# EAGLE design main (EAGLE 7.3.0)
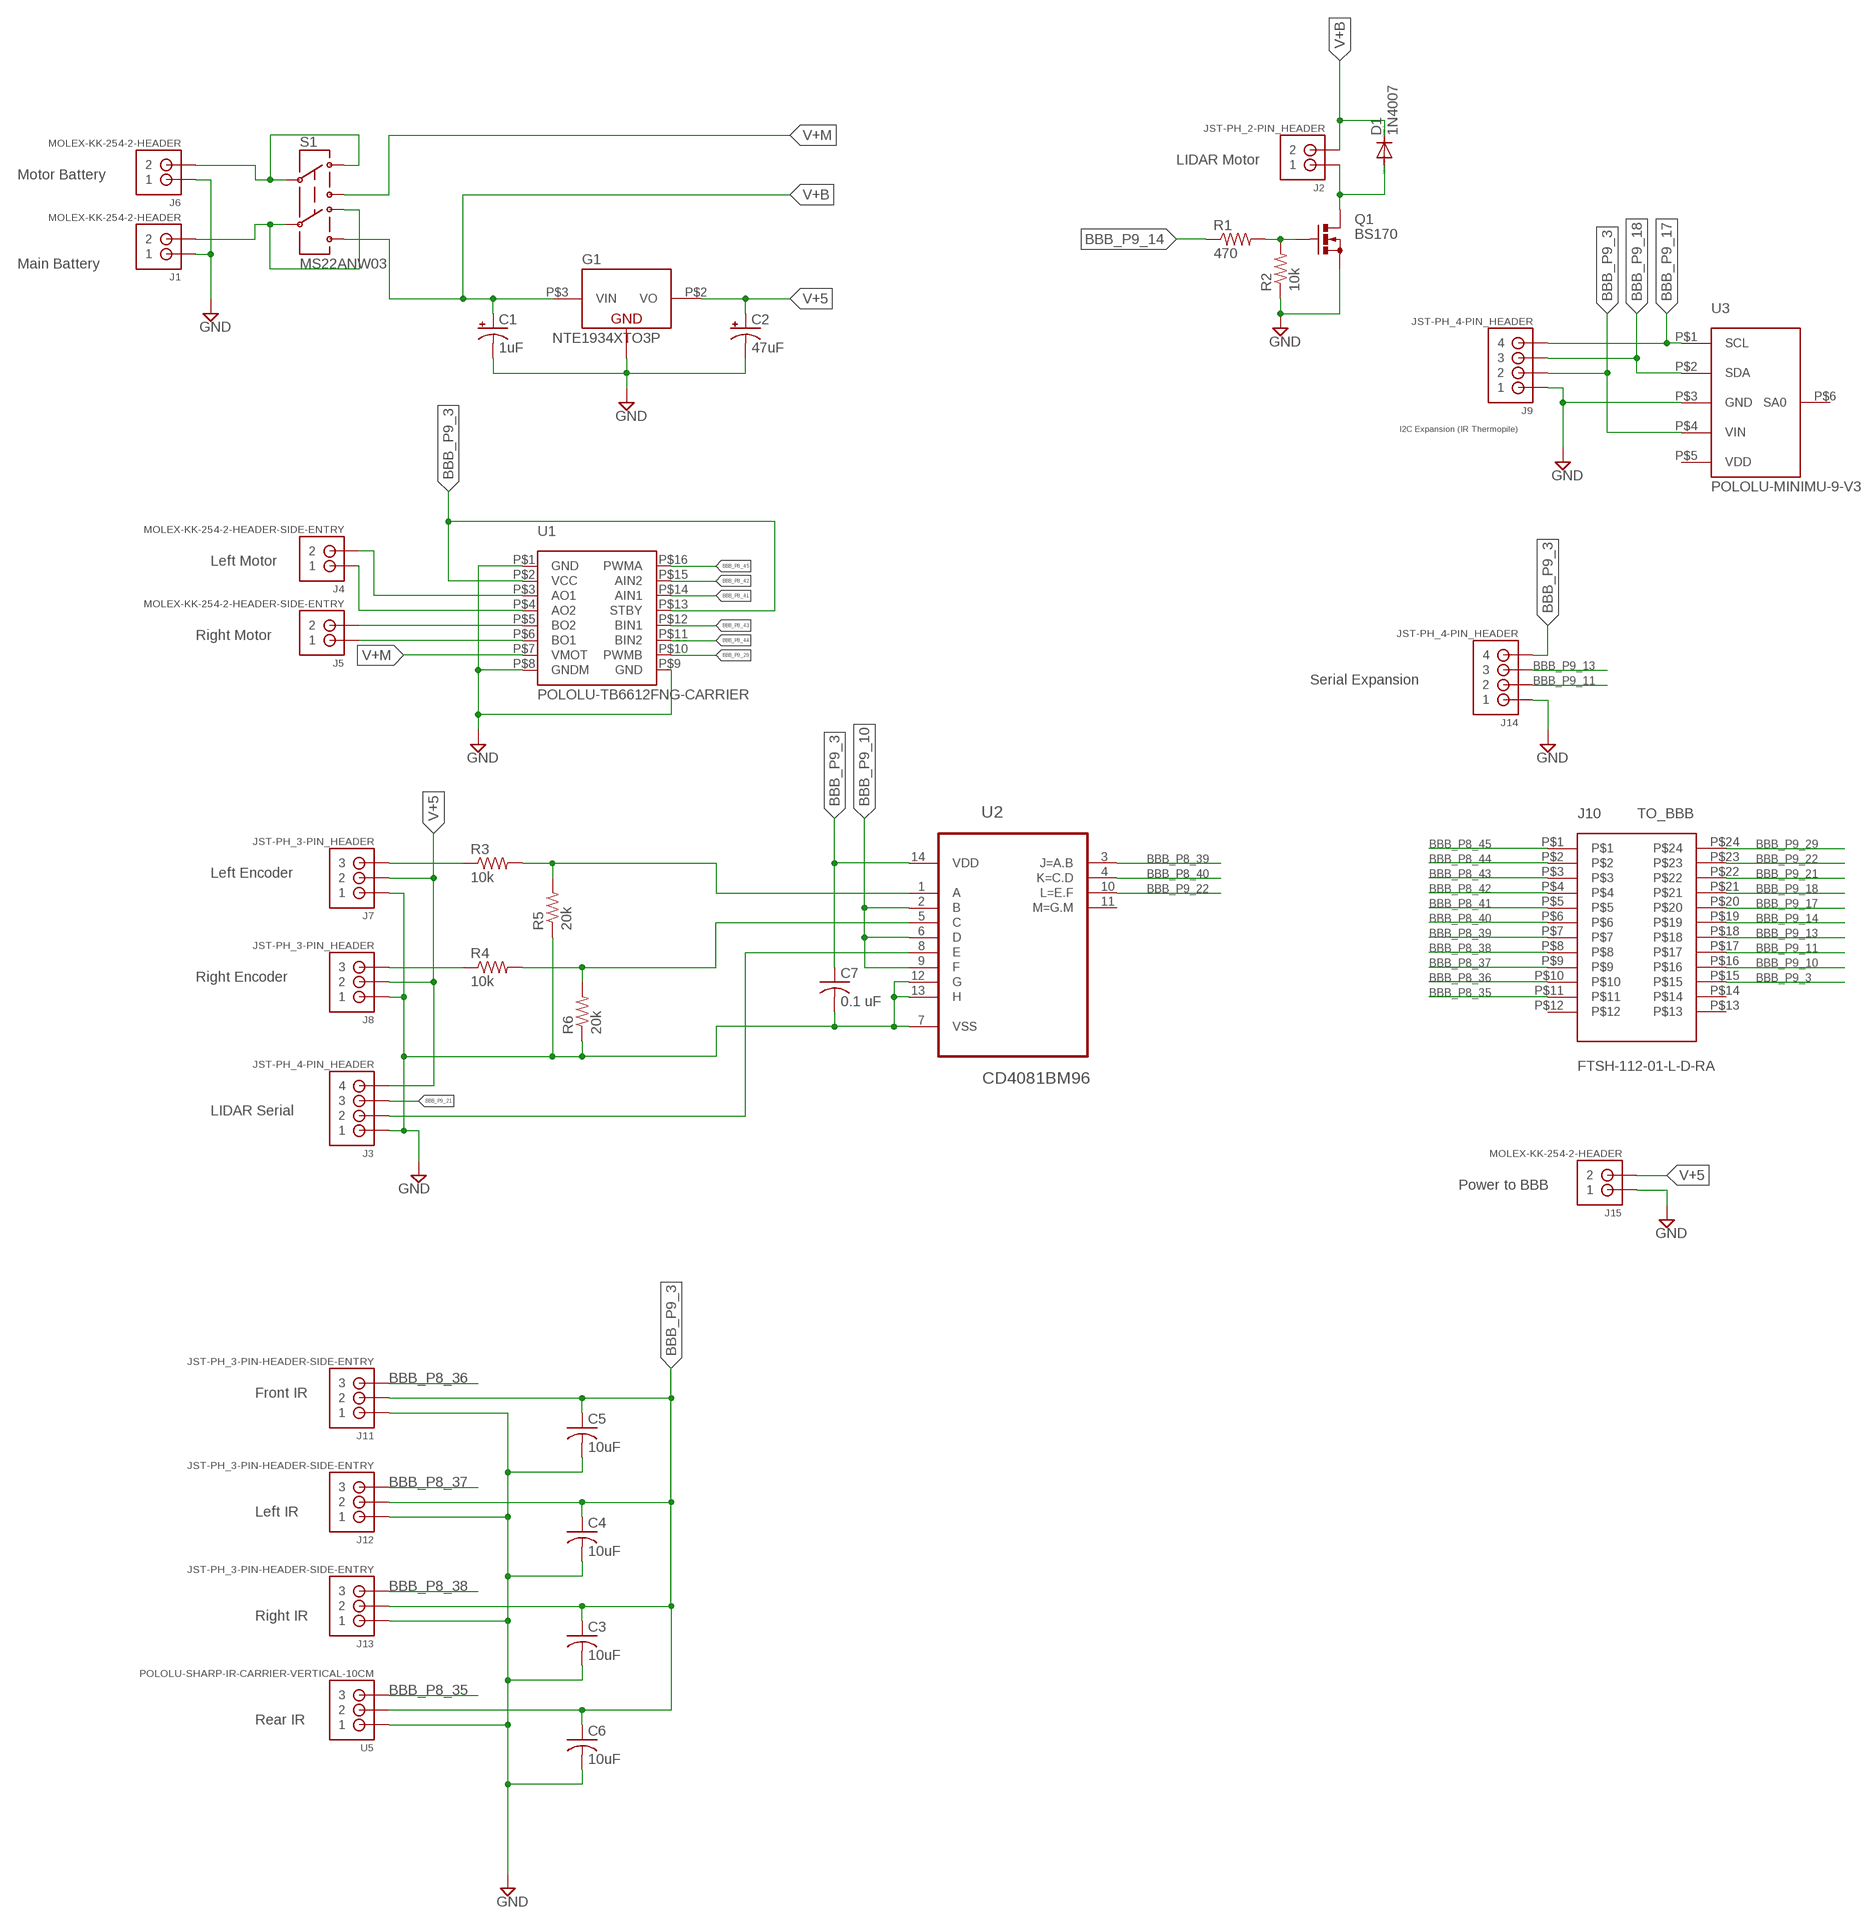
[diagram p0: schematic, sheet 1]

## Parts
C1  1uF  CPOL-USB  [PANASONIC_B]
C2  47uF  CPOL-USC  [PANASONIC_C]
C3  10uF  C-USC0603  [C0603]
C4  10uF  C-USC0603  [C0603]
C5  10uF  C-USC0603  [C0603]
C6  10uF  C-USC0603  [C0603]
C7  0.1 uF  C-USC0603  [C0603]
D1  1N4007  1N4004  [DO41-10]
G1  NTE1934XTO3P  [TO3P]
J1  MOLEX-KK-254-2-HEADER  [MOLEX-KK-254-2-HEADER]
J2  JST-PH_2-PIN_HEADER  [JST_B2B-PH_HEADER]
J3  JST-PH_4-PIN_HEADER  [JST_B4B-PH_HEADER]
J4  MOLEX-KK-254-2-HEADER-SIDE-ENTRY  [MOLEX-KK-254-2-HEADER-SIDE-ENTRY]
J5  MOLEX-KK-254-2-HEADER-SIDE-ENTRY  [MOLEX-KK-254-2-HEADER-SIDE-ENTRY]
J6  MOLEX-KK-254-2-HEADER  [MOLEX-KK-254-2-HEADER]
J7  JST-PH_3-PIN_HEADER  [JST_B3B-PH_HEADER]
J8  JST-PH_3-PIN_HEADER  [JST_B3B-PH_HEADER]
J9  JST-PH_4-PIN_HEADER  [JST_B4B-PH_HEADER]
J10  FTSH-112-01-L-D-RA  FTSH-112-CONNRIGHT-ANGLE  [FTSH-112-01-L-D-RA]
J11  JST-PH_3-PIN-HEADER-SIDE-ENTRY  [JST-S3B-PH-K-S]
J12  JST-PH_3-PIN-HEADER-SIDE-ENTRY  [JST-S3B-PH-K-S]
J13  JST-PH_3-PIN-HEADER-SIDE-ENTRY  [JST-S3B-PH-K-S]
J14  JST-PH_4-PIN_HEADER  [JST_B4B-PH_HEADER]
J15  MOLEX-KK-254-2-HEADER  [MOLEX-KK-254-2-HEADER]
Q1  BS170  [SOT54E]
R1  470  R-US_R0402  [R0402]
R2  10k  R-US_R0402  [R0402]
R3  10k  R-US_R0402  [R0402]
R4  10k  R-US_R0402  [R0402]
R5  20k  R-US_R0402  [R0402]
R6  20k  R-US_R0402  [R0402]
S1  MS22ANW03  SWITCH-DPDT-NKK-MS22ANW03NKK-MS22ANW03  [SWITCH-DPDT-NKK-MS22ANW03]
U1  POLOLU-TB6612FNG-CARRIER  [POLOLU-TB6612FNG-CARRIER]
U2  CD4081BM96  CD4081BESO-14  [SO14]
U3  POLOLU-MINIMU-9-V3  [POLOLU-MINIMU-9-V3]
U5  POLOLU-SHARP-IR-CARRIER-VERTICAL-10CM  [POLOLU-SHARP-IR-CARRIER-VERTICAL-GP2Y0D8**Z0F]

## Nets
BBB_P8_35: J10.P$11 U5.P$3
BBB_P8_36: J10.P$10 J11.P$3
BBB_P8_37: J10.P$9 J12.P$3
BBB_P8_38: J10.P$8 J13.P$3
BBB_P8_39: J10.P$7 U2.3(J=A.B)
BBB_P8_39_AND_INPUT: R3.2 R5.2 U2.1(A)
BBB_P8_40: J10.P$6 U2.4(K=C.D)
BBB_P8_40_AND_INPUT: R4.2 R6.2 U2.5(C)
BBB_P8_41: J10.P$5 U1.P$14(AIN1)
BBB_P8_42: J10.P$4 U1.P$15(AIN2)
BBB_P8_43: J10.P$3 U1.P$12(BIN1)
BBB_P8_44: J10.P$2 U1.P$11(BIN2)
BBB_P8_45: J10.P$1 U1.P$16(PWMA)
BBB_P9_3: C3.1 C4.1 C5.1 C6.1 C7.1 J9.P2 J10.P$15 J11.P$2 J12.P$2 J13.P$2 J14.P4 U1.P$2(VCC) U1.P$13(STBY) U2.14(VDD) U3.P$4(VIN) U5.P$2
BBB_P9_10: J10.P$16 U2.2(B) U2.6(D) U2.9(F)
BBB_P9_11: J10.P$17 J14.P2
BBB_P9_13: J10.P$18 J14.P3
BBB_P9_14: J10.P$19 R1.1
BBB_P9_17: J9.P4 J10.P$20 U3.P$1(SCL)
BBB_P9_18: J9.P3 J10.P$21 U3.P$2(SDA)
BBB_P9_21: J3.P3 J10.P$22
BBB_P9_22: J10.P$23 U2.10(L=E.F)
BBB_P9_29: J10.P$24 U1.P$10(PWMB)
GND: C1.- C2.- C3.2 C4.2 C5.2 C6.2 C7.2 G1.P$1(GND) J1.P$1 J3.P1 J6.P$1 J7.P1 J8.P1 J9.P1 J11.P$1 J12.P$1 J13.P$1 J14.P1 J15.P$1 Q1.S R2.1 R5.1 R6.1 U1.P$1(GND) U1.P$8(GNDM) U1.P$9(GND) U2.7(VSS) U2.12(G) U2.13(H) U3.P$3(GND) U5.P$1
N$1: Q1.G R1.2 R2.2
N$2: D1.A J2.P1 Q1.D
N$3: J5.P$1 U1.P$6(BO1)
N$4: J5.P$2 U1.P$5(BO2)
N$5: J4.P$1 U1.P$4(AO2)
N$6: J4.P$2 U1.P$3(AO1)
N$7: J7.P3 R3.1
N$8: J6.P$2 S1.P$1 S1.P$2
N$9: J1.P$2 S1.P$4 S1.P$5
N$11: J8.P3 R4.1
N$21: J3.P2 U2.8(E)
V+5: C2.+ G1.P$2(VO) J3.P4 J7.P2 J8.P2 J15.P$2
V+B: C1.+ D1.C G1.P$3(VIN) J2.P2 S1.P$6
V+M: S1.P$3 U1.P$7(VMOT)
Unconnected: J10.P$12 J10.P$13 J10.P$14 U2.11(M=G.M) U3.P$6(SA0)

## Notes on the sheet
- LIDAR Motor
- Motor Battery
- Main Battery
- I2C Expansion (IR Thermopile)
- Left Motor
- Right Motor
- Serial Expansion
- TO_BBB
- Left Encoder
- Right Encoder
- LIDAR Serial
- Power to BBB
- Front IR
- Left IR
- Right IR
- Rear IR

## Power pins joined to a net without a drawn wire
VDD: U3.P$5(VDD)

## Library data of the parts
C1 C2 = rcl:CPOL-US: POLARIZED CAPACITOR, American symbol
C3-C6 = resistor:C-US: CAPACITOR, American symbol
C7 = rcl:C-US: CAPACITOR, American symbol
D1 = diode:1N4004: DIODE general purpose rectifier, 1 A
G1 = custom:NTE1934X
J1 J6 J15 = custom:MOLEX-KK-254-2-HEADER: Molex KK 254 Wire to Board Header - 22-23-2021 Max current per contact: 4.0 A Max voltage: 250 V 0.1 inch pitch http://www.molex.com/molex/products/datasheet.jsp?part=active/0022232021_PCB_HEADERS.xml&channel=Products&Lang=en-US
J2 = SRG:JST-PH_2-PIN_HEADER: 2-pin JST PH Shrouded Header, top entry P/N B2B-PH-K-S Mating connector PHR-2 Mating cable assembly: Sparkfun PRT-09914 <http://www.sparkfun.com/products/9914>
J3 J9 J14 = SRG:JST-PH_4-PIN_HEADER: 4-pin JST PH Shrouded Header, top entry P/N B4B-PH-K-S Mating connector PHR-4 Mating cable assembly: Sparkfun PRT-09916 <http://www.sparkfun.com/products/9916>
J4 J5 = custom:MOLEX-KK-254-2-HEADER-SIDE-ENTRY: Molex KK 254 Wire to Board Header - Side Entry - 22-12-2024 Max current per contact: 4.0 A Max voltage: 250 V 0.1 inch pitch http://www.farnell.com/datasheets/1973599.pdf
J7 J8 = SRG:JST-PH_3-PIN_HEADER: 3-pin JST PH Shrouded Header, top entry P/N B3B-PH-K-S Mating connector PHR-3
J10 = custom:FTSH-112-CONN: SAMTEC FTSH-112-* HEADER, 1.27MM (0.05 in.), 2X12 POSITION 1.75 A Current Rating @ 80 degrees C ambient Mates with FFSD, FFTP, CLP, FLE, SFMC http://www.newark.com/webapp/wcs/stores/servlet/ProductDisplay?catalogId=15003&langId=-1&urlRequestType=Base&partNumber=01R5259&storeId=10194 http://www.newark.com/webapp/wcs/stores/servlet/ProductDisplay?catalogId=15003&langId=-1&urlRequestType=Base&partNumber=01R5256&storeId=10194 Datasheet: http://www.farnell.com/datasheets/1596288.pdf Drawing: http://www.farnell.com/cad/1561347.pdf
J11-J13 = custom:JST-PH_3-PIN-HEADER-SIDE-ENTRY: 3-pin JST PH Shrouded Header, side entry P/N S3B-PH-K-S Mating connector PHR-3
Q1 = transistor-small-signal:BS170: N-CHANNEL MOS FET
R1 R2 = rcl:R-US_: RESISTOR, American symbol
R3-R6 = resistor:R-US_: RESISTOR, American symbol
S1 = custom:SWITCH-DPDT-NKK-MS22ANW03: NKK SWITCHES MS22ANW03 Slide Switch, DPDT, Vertical, Through Hole, 6 A, 250 V http://www.newark.com/nkk-switches/ms22anw03/switch-slide-dpdt-6a-250v-th/dp/11X3380 http://www.farnell.com/datasheets/1783588.pdf
U1 = custom:POLOLU-TB6612FNG-CARRIER: Pololu TB6612FNG Dual Motor Driver Carrier Motor driver: TB6612FNG Motor channels: 2 Minimum operating voltage: 4.5 V Maximum operating voltage: 13.5 V Continuous output current per channel: 1 A Peak output current per channel: 3 A Continuous paralleled output current: 2 A Maximum PWM frequency: 100 kHz Minimum logic voltage: 2.7 V Maximum logic voltage: 5.5 V Reverse voltage protection?: Y Pololu item #: 713 (https://www.pololu.com/product/713)
U2 = custom:CD4081BE: CMOS AND Gates
U3 = custom:POLOLU-MINIMU-9-V3: Pololu MinIMU-9 v3 Gyro, Accelerometer, and Compass (L3GD20H and LSM303D Carrier) Dimensions Size: 0.8" × 0.5" × 0.1" Weight: 0.7 g General Specifications Interface: I²C Minimum operating voltage: 2.5 V Maximum operating voltage: 5.5 V Axes: pitch (x), roll (y), and yaw (z) Measurement range: ±245, ±500, or ±2000°/s (gyro) ±2, ±4, ±6, ±8, or ±16 g (accelerometer) ±2, ±4, ±8, or ±12 gauss (magnetometer) Supply current: 6 mA I2C Addresses Sensor Slave Address (default) Slave Address (SA0 driven low) L3GD20H (gyro) 1101011b 1101010b LSM303D (accelerometer and magnetometer) 0011101b 0011110b https://www.pololu.com/product/2468
U5 = custom:POLOLU-SHARP-IR-CARRIER-VERTICAL-10CM: Pololu Carrier with Sharp GP2Y0D810Z0F Digital Distance Sensor 10cm Detects the presence of objects 2-10 cm away. Does not detect actual distance. Dimensions Size: 0.85″ × 0.35″ × 0.41″1 Weight: 1.5 g1 Specifications Maximum range: 10 cm Minimum range: 2 cm Sampling rate: 390 Hz2 Minimum operating voltage: 2.7 V Maximum operating voltage: 6.2 V Supply current: 5 mA3 Output type: digital4 Notes 1 Without included optional headers. 2 Typical; can be as low as 265 Hz. 3 Average; this sensor draws current in large, short bursts, so it might help to place 10 µF capacitor or larger across power and ground close to the sensor in some applications. 4 Low when detecting an object, high otherwise. https://www.pololu.com/product/1134

## Board
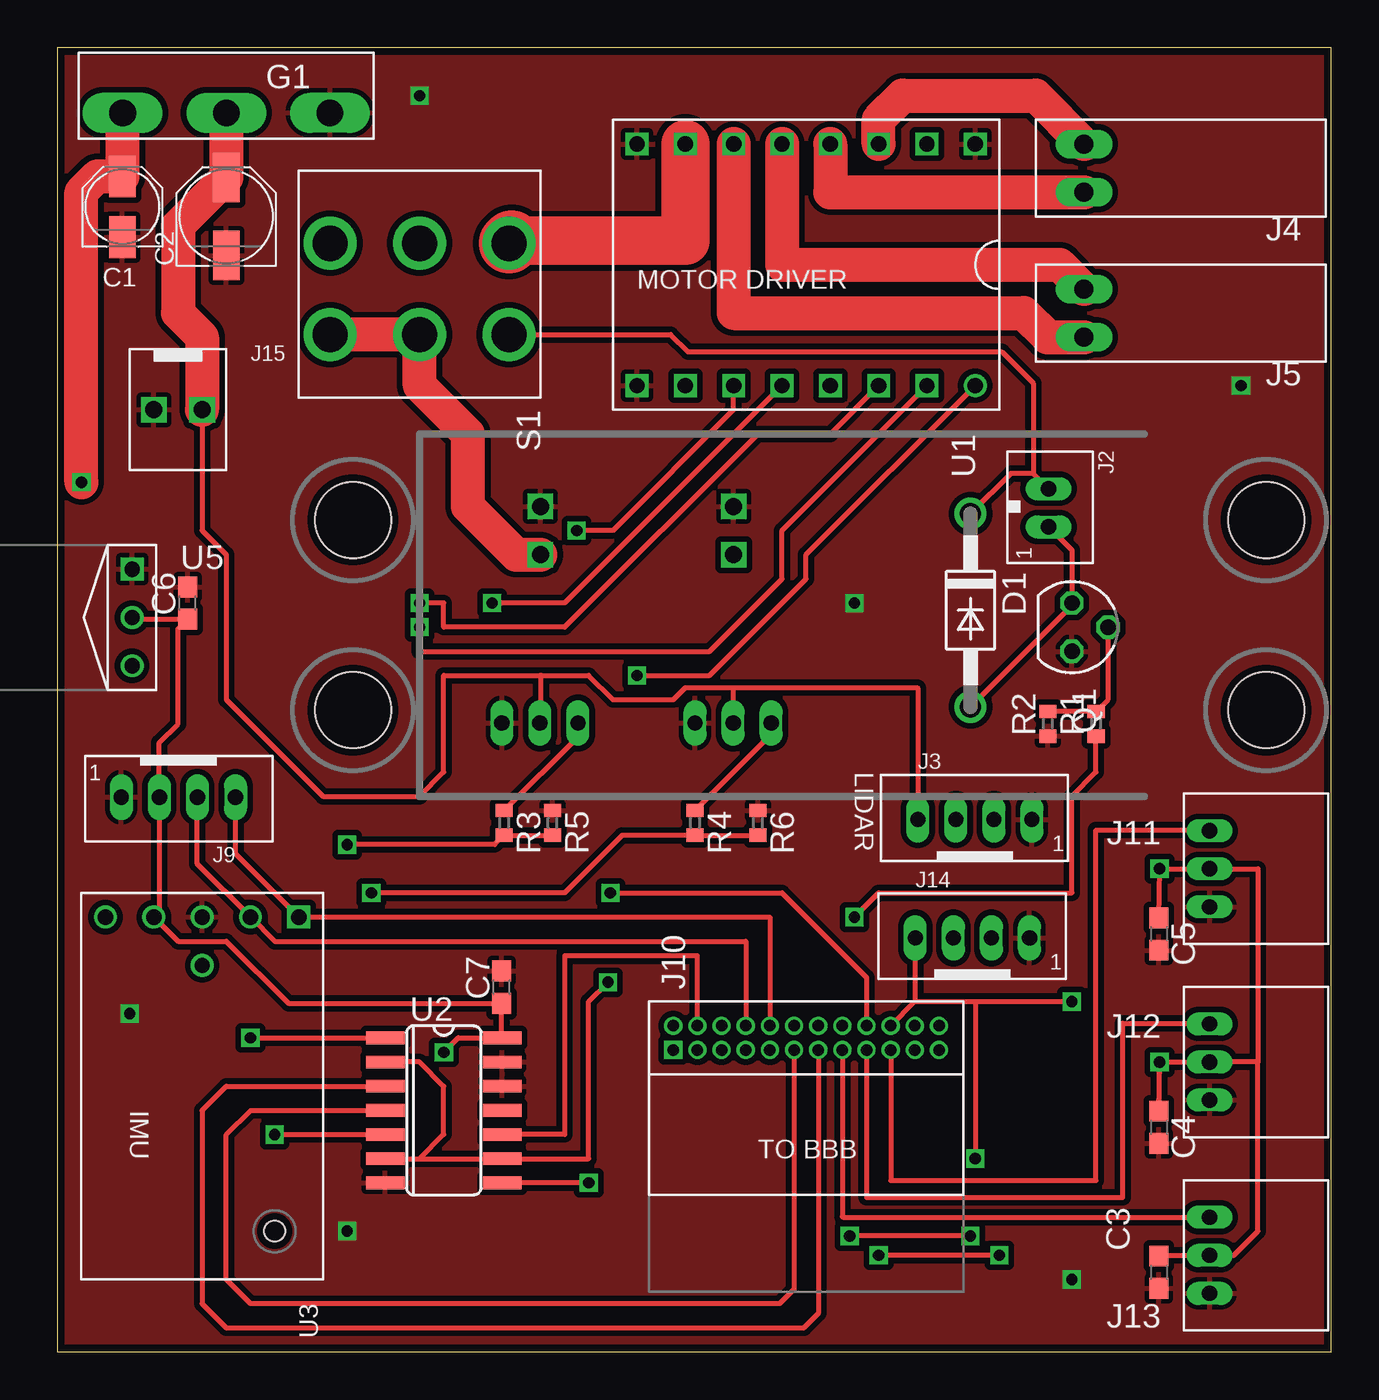
[diagram p1: board, top side]
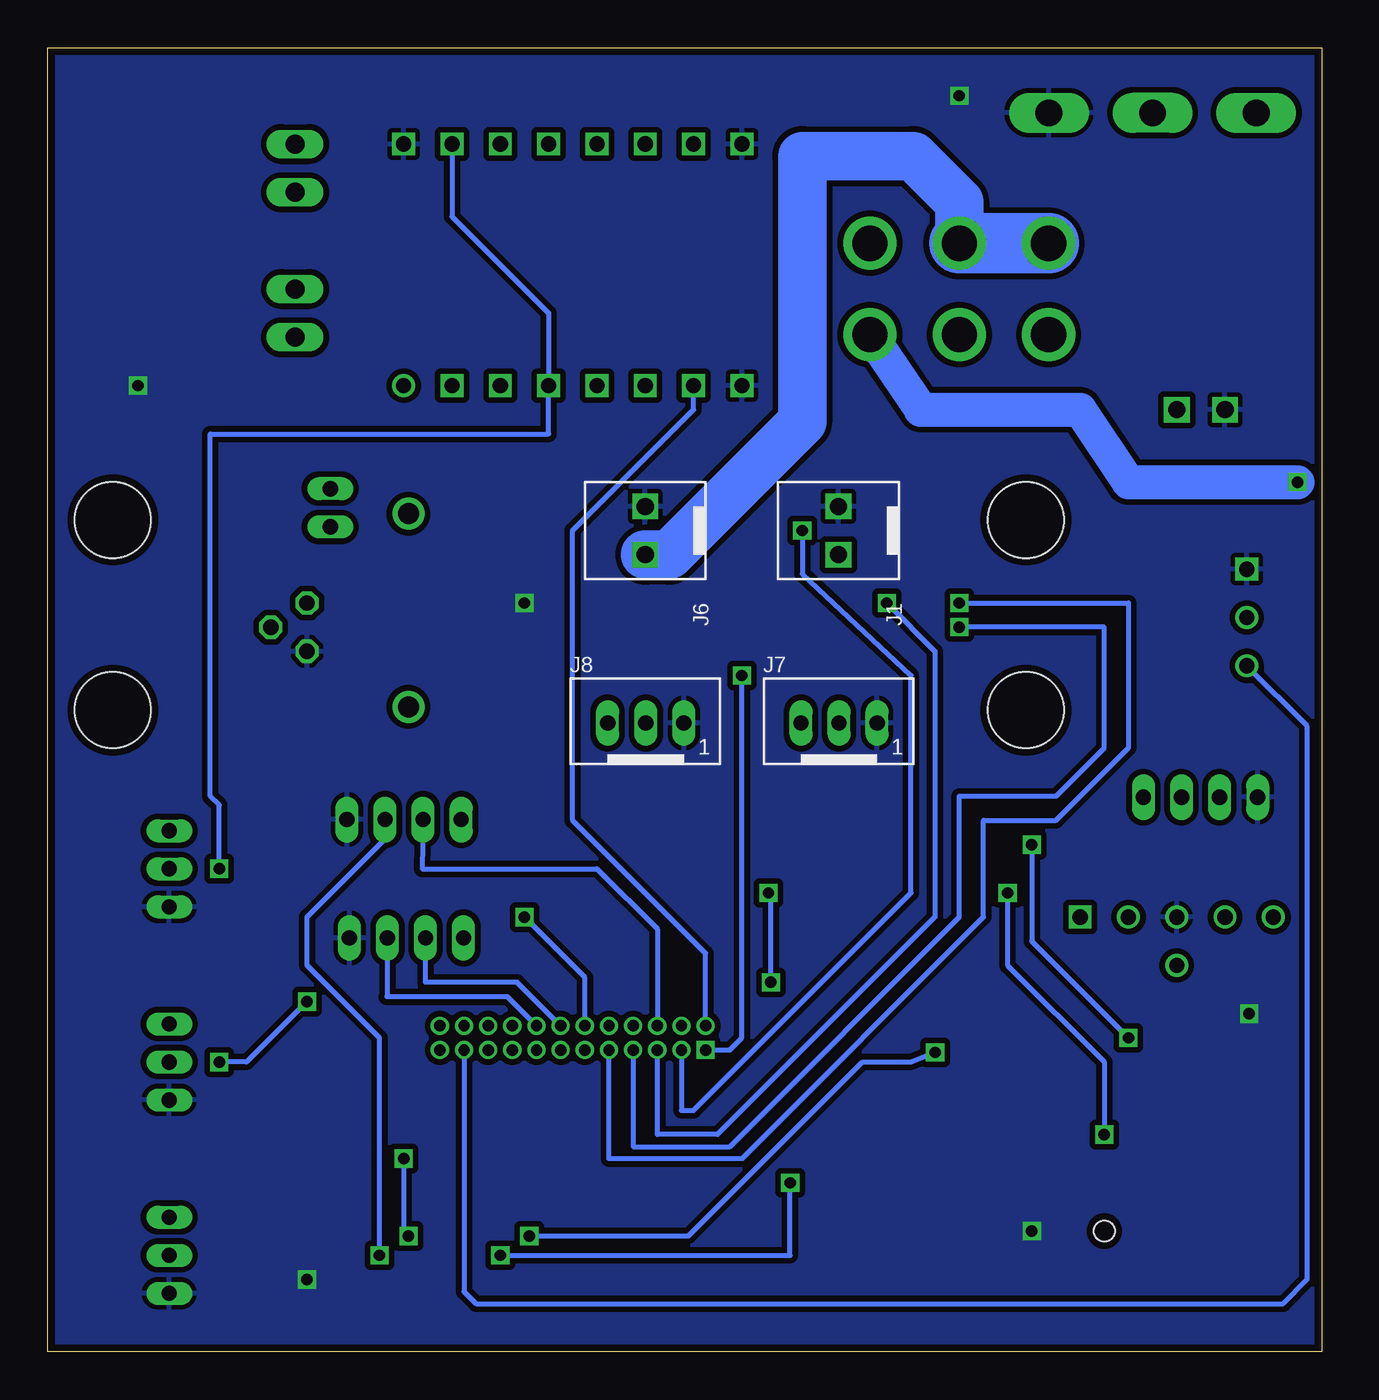
[diagram p2: board, bottom side, seen from below]

Size 66.98 x 68.57 mm. Coordinates in mm from the lower left corner, seen from the top.
Outline: 0,0 66.98,0 66.98,68.57 0,68.57 0,0
Copper layers (1*16): Top 0.0356mm / dielectric 1.5011mm / Bottom 0.0356mm
Design rules "LaenPCBOrder": minimum track width 6mil, minimum drill 13mil, track to track 6mil, track to pad 6mil, pad to pad 6mil, via to via 6mil, smd to smd 6mil, copper to edge 15mil, drill to drill 6mil, minimum pad ring 7mil, minimum via ring 7mil, stop-mask expansion 3mil, vias tented up to drill 0mil, thermal gap 10mil
Holes 4 mm at 15.55,43.74 15.55,33.73 63.55,43.74 63.55,33.73

### Footprints (pad centres in the part's own frame; a part is rotated, then mirrored left to right if it is on the bottom)
PANASONIC_B = smd 2.2 x 1.4: + 1.6,0; - -1.6,0
PANASONIC_C = smd 2.6 x 1.4: + 2.05,0; - -2.05,0
C0603 = smd 1.1 x 1: 1 -0.85,0; 2 0.85,0
DO41-10 = drill 1.118: A 5.08,0; C -5.08,0
TO3P = drill 1.4 long: P$1 -5.45,0.9; P$2 0,0.9; P$3 5.45,0.9
MOLEX-KK-254-2-HEADER = drill 0.9 square: P$1 -1.27,0; P$2 1.27,0
JST_B2B-PH_HEADER = drill 0.8 long: P1 1.075,0.048; P2 -0.925,0.048
JST_B4B-PH_HEADER = drill 0.8 long: P1 2.98,0.048; P2 0.98,0.048; P3 -1.02,0.048; P4 -3.02,0.048
MOLEX-KK-254-2-HEADER-SIDE-ENTRY = drill 1 long: P$1 0,1.27; P$2 0,-1.27
JST_B3B-PH_HEADER = drill 0.8 long: P1 2.027,0.048; P2 0.028,0.048; P3 -1.972,0.048
FTSH-112-01-L-D-RA = drill 0.6 pad 0.94 square: P$1 -0.635,6.985 | drill 0.6 pad 0.94: P$2 -0.635,5.715; P$3 -0.635,4.445; P$4 -0.635,3.175; P$5 -0.635,1.905; P$6 -0.635,0.635; P$7 -0.635,-0.635; P$8 -0.635,-1.905; P$9 -0.635,-3.175; P$10 -0.635,-4.445; P$11 -0.635,-5.715; P$12 -0.635,-6.985; P$13 0.635,-6.985; P$14 0.635,-5.715; P$15 0.635,-4.445; P$16 0.635,-3.175; P$17 0.635,-1.905; P$18 0.635,-0.635; P$19 0.635,0.635; P$20 0.635,1.905; P$21 0.635,3.175; P$22 0.635,4.445; P$23 0.635,5.715; P$24 0.635,6.985
JST-S3B-PH-K-S = drill 0.8 pad 1.143 long: P$1 0,2; P$2 0,0; P$3 0,-2
SOT54E = drill 0.813 octagon: D -1.27,0; G 0,1.905; S 1.27,0
R0402 = smd 0.7 x 0.9: 1 -0.65,0; 2 0.65,0
SWITCH-DPDT-NKK-MS22ANW03 = drill 1.854 pad 2.794: P$1 -2.4,-4.699; P$2 -2.4,0; P$3 -2.4,4.699; P$4 2.4,-4.699; P$5 2.4,0; P$6 2.4,4.699
POLOLU-TB6612FNG-CARRIER = drill 0.8 square: P$1 -6.35,8.89; P$2 -6.35,6.35; P$3 -6.35,3.81; P$4 -6.35,1.27; P$5 -6.35,-1.27; P$6 -6.35,-3.81; P$7 -6.35,-6.35; P$8 -6.35,-8.89; P$9 6.35,-8.89; P$10 6.35,-6.35; P$11 6.35,-3.81; P$12 6.35,-1.27; P$13 6.35,1.27; P$14 6.35,3.81; P$15 6.35,6.35 | drill 0.8: P$16 6.35,8.89
SO14 = smd 0.66 x 2.032: 1 -3.81,-3.073; 2 -2.54,-3.073; 3 -1.27,-3.073; 4 0,-3.073; 5 1.27,-3.073; 6 2.54,-3.073; 7 3.81,-3.073; 8 3.81,3.073; 9 2.54,3.073; 10 1.27,3.073; 11 0,3.073; 12 -1.27,3.073; 13 -2.54,3.073; 14 -3.81,3.073
POLOLU-MINIMU-9-V3 = drill 0.8 square: P$1 -8.89,5.08 | drill 0.8: P$2 -8.89,2.54; P$3 -8.89,0; P$4 -8.89,-2.54; P$5 -8.89,-5.08; P$6 -6.35,0 | hole 1.092: 7.62,3.81
POLOLU-SHARP-IR-CARRIER-VERTICAL-GP2Y0D8**Z0F = drill 0.8 square: P$1 0,2.54 | drill 0.8: P$2 0,0; P$3 0,-2.54

### Placement (x,y rotation side)
C1  3.43,60.2 90 top
C2  8.89,59.69 90 top
C3  57.91,4.19 270 top
C4  57.91,11.81 270 top
C5  57.91,21.97 270 top
C6  6.86,39.37 90 top
C7  23.37,19.18 90 top
D1  48.01,38.99 270 top
G1  8.89,66.04 180 top
J1  25.4,43.18 270 bottom
J2  52.07,44.45 270 top
J3  48.26,27.94 0 top
J4  53.98,62.23 180 top
J5  53.98,54.61 180 top
J6  35.56,43.18 270 bottom
J7  25.4,33.02 0 bottom
J8  35.56,33.02 0 bottom
J9  6.35,29.21 180 top
J10  39.37,16.51 90 top
J11  60.58,25.4 180 top
J12  60.58,15.24 180 top
J13  60.58,5.08 180 top
J14  48.13,21.72 0 top
J15  6.35,49.53 0 top
Q1  53.34,38.1 270 top
R1  54.61,33.02 90 top
R2  52.07,33.02 90 top
R3  23.5,27.81 270 top
R4  33.53,27.81 270 top
R5  26.04,27.81 270 top
R6  36.83,27.81 270 top
S1  19.05,55.88 270 top
U1  39.37,57.15 270 top
U2  20.32,12.7 270 top
U3  7.62,13.97 270 top
U5  3.94,38.61 0 top

### Tracks (layer width: path | path; a pad name or v marks a point on that pad's centre or on a via)
BBB_P8_35
  Bottom 0.254: J10.P$11 45.09,3.17 44.45,2.54 2.03,2.54 0.76,3.81 0.76,32.89 U5.P$3
BBB_P8_36
  Top 0.254: J10.P$10 43.81,9.02 54.61,9.02 54.61,27.43 60.58,27.43 J11.P$3
BBB_P8_37
  Top 0.254: J10.P$9 42.55,8.13 56.01,8.13 56.01,17.27 60.58,17.27 J12.P$3
BBB_P8_38
  Top 0.254: J10.P$8 41.27,7.11 41.31,7.08 J13.P$3
BBB_P8_39
  Top 0.254: J10.P$7 40.01,2.03 39.24,1.27 8.89,1.27 7.62,2.54 7.62,12.7 8.89,13.97 U2.3
BBB_P8_39_AND_INPUT  (via drill 0.6)
  Top 0.254: v15.24,26.67 23,26.67 R3.2 R5.2 | v10.16,16.51 U2.1
  Bottom 0.254: v15.24,26.67 15.24,21.59 v10.16,16.51
BBB_P8_40
  Top 0.254: J10.P$6 38.73,3.3 37.97,2.54 10.16,2.54 8.89,3.81 8.89,11.43 10.16,12.7 U2.4
BBB_P8_40_AND_INPUT  (via drill 0.6)
  Top 0.254: v16.51,24.13 26.67,24.13 29.7,27.16 R4.2 R6.2 | v11.43,11.43 U2.5
  Bottom 0.254: v16.51,24.13 16.51,20.32 11.43,15.24 v11.43,11.43
BBB_P8_41  (via drill 0.6)
  Top 0.254: U1.P$14 40.64,48.26 36.83,48.26 26.67,38.1 20.32,38.1 20.32,39.37 v19.05,39.37
  Bottom 0.254: v19.05,39.37 10.16,39.37 10.16,31.75 13.97,27.94 17.78,27.94 17.78,22.86 30.48,10.16 37.47,10.16 J10.P$5
BBB_P8_42  (via drill 0.6)
  Top 0.254: v19.05,38.1 19.05,36.83 34.29,36.83 38.1,40.64 38.1,43.18 U1.P$15
  Bottom 0.254: J10.P$4 36.2,10.79 31.11,10.79 19.05,22.86 19.05,29.21 13.97,29.21 11.43,31.75 11.43,38.1 v19.05,38.1
BBB_P8_43  (via drill 0.6)
  Top 0.254: U1.P$12 26.67,39.37 v22.86,39.37
  Bottom 0.254: v22.86,39.37 20.32,36.83 20.32,22.86 31.75,11.43 34.92,11.43 J10.P$3
BBB_P8_44  (via drill 0.6)
  Top 0.254: U1.P$11 35.56,49.53 29.21,43.18 v27.3,43.18
  Bottom 0.254: J10.P$2 33.66,12.7 33.02,12.7 21.59,24.13 21.59,35.56 27.3,40.89 v27.3,43.18
BBB_P8_45  (via drill 0.6)
  Top 0.254: v30.48,35.56 34.29,35.56 39.37,40.64 39.37,41.91 U1.P$16
  Bottom 0.254: J10.P$1 31.11,15.88 30.48,16.51 v30.48,35.56
BBB_P9_3  (via drill 0.6)
  Top 0.254: 63.12,15.24 63.12,6.35 61.85,5.08 J13.P$2 57.95,5.08 C3.1 | 63.12,15.24 63.12,25.4 J11.P$2 v57.95,25.4 C5.1 | 63.12,15.24 J12.P$2 v57.95,15.24 | v57.95,15.24 C4.1 57.91,15.2 v57.95,15.24 | U5.P$2 4.03,38.52 C6.1 6.35,38.01 6.35,33.02 5.37,32.04 J9.P2 5.37,23.15 U3.P$4 6.35,21.59 8.89,21.59 12.15,18.33 C7.1 23.37,16.54 U2.14 21.08,16.51 v20.32,15.75 | 48.26,18.41 v53.34,18.41 | 45.09,18.41 45.11,18.44 J14.P4 | J10.P$15 45.09,18.41 | 45.09,18.41 48.26,18.41 | 48.26,18.41 v48.26,10.16 | v48.01,6.1 v41.66,6.1
  Bottom 0.254: U1.P$2 45.72,59.69 40.64,54.61 U1.P$13 40.64,48.26 58.42,48.26 58.42,29.21 57.95,28.74 v57.95,25.4 | v53.34,18.41 56.52,15.24 v57.95,15.24 | v48.26,10.16 48.26,6.35 v48.01,6.1 | v41.66,6.1 33.27,6.1 24.13,15.24 21.59,15.24 v20.32,15.75
BBB_P9_10  (via drill 0.6)
  Top 0.254: U2.2 19.05,15.24 20.32,13.97 20.32,11.43 19.05,10.16 U2.6 U2.9 27.94,10.16 27.94,18.41 v28.96,19.43 | v29.08,24.13 38.1,24.13 42.55,19.68 J10.P$16
  Bottom 0.254: v28.96,19.43 28.96,24 v29.08,24.13
BBB_P9_11
  Bottom 0.254: J10.P$17 42.8,18.67 49.15,18.67 49.11,18.7 J14.P2
BBB_P9_13
  Bottom 0.254: J10.P$18 42.29,19.43 47.12,19.43 47.11,19.43 J14.P3
BBB_P9_14  (via drill 0.6)
  Top 0.254: v41.91,22.86 43.18,24.13 53.34,24.13 53.34,29.21 54.61,30.48 R1.1
  Bottom 0.254: J10.P$19 38.73,19.68 v41.91,22.86
BBB_P9_17
  Top 0.254: J9.P4 9.37,26.19 U3.P$1 37.47,22.86 J10.P$20
BBB_P9_18
  Top 0.254: J9.P3 7.37,25.65 U3.P$2 11.43,21.59 36.2,21.59 J10.P$21
BBB_P9_21
  Bottom 0.254: J3.P3 47.29,25.4 38.1,25.4 34.92,22.23 J10.P$22
BBB_P9_22
  Top 0.254: J10.P$23 33.66,20.83 26.67,20.83 26.67,11.43 U2.10
BBB_P9_29
  Bottom 0.254: J10.P$24 32.38,20.95 39.37,27.94 39.37,43.18 33.02,49.53 U1.P$10
GND  (via drill 0.6)
  other vias: 15.24,6.35 3.81,17.78 53.34,3.81 62.23,50.8 41.91,39.37 19.05,66.04
  pour Top (isolate 0.305): 0,68.58 0,0 67.31,0 67.31,68.58
  pour Bottom (isolate 0.305): 0,68.58 0,0 67.31,0 67.31,68.58
N$1
  Top 0.254: Q1.G 55.24,34.3 R1.2 R2.2
N$2
  Top 0.254: D1.A 53.47,39.37 Q1.D 53.34,42.15 J2.P1
N$3
  Top 1.778: U1.P$6 35.56,54.61 50.8,54.61 52.07,53.34 J5.P$1
N$4
  Top 1.778: U1.P$5 38.1,57.15 52.7,57.15 J5.P$2
N$5
  Top 1.778: U1.P$4 40.64,60.96 J4.P$1
N$6
  Top 1.778: U1.P$3 43.18,64.77 44.45,66.04 51.44,66.04 J4.P$2
N$7
  Top 0.254: R3.1 27.37,32.34 J7.P3
N$8
  Bottom 2.54: S1.P$2 19.05,60.45 21.46,62.87 27.3,62.87 27.3,48.9 34.29,41.91 J6.P$2
  Bottom 3.175: S1.P$2 S1.P$1
N$9
  Top 1.778: S1.P$4 S1.P$5 19.05,50.8 21.59,48.26 21.59,44.45 24.13,41.91 J1.P$2
N$11
  Top 0.254: R4.1 37.53,32.47 J8.P3
N$21  (via drill 0.6)
  Top 0.254: v49.53,5.08 v43.18,5.08 | v27.94,8.89 U2.8
  Bottom 0.254: v43.18,5.08 27.94,5.08 v27.94,8.89 | v49.53,5.08 49.53,16.51 53.34,20.32 53.34,22.86 49.24,26.96 J3.P2
V+5
  Top 0.254: J15.P$2 7.62,43.18 8.89,41.91 8.89,34.29 13.97,29.21 19.05,29.21 20.32,30.48 20.32,35.56 25.4,35.56 25.43,35.53 | 35.56,34.92 33.02,34.92 32.38,34.29 29.21,34.29 27.94,35.56 25.45,35.56 25.43,35.53 | 35.56,34.92 45.21,34.92 45.24,34.9 J3.P4 | J7.P2 25.43,33.12 25.43,35.53 | J8.P2 35.56,33.09 35.56,34.92
  Top 1.778: G1.P$2 C2.+ 6.35,59.2 6.35,54.61 7.62,53.34 J15.P$2
V+B  (via drill 0.6)
  Top 0.254: S1.P$6 32.24,53.48 33.15,52.58 49.66,52.58 51.31,50.93 51.31,46.18 | 51.31,46.18 J2.P2 | 51.31,46.18 50.12,46.18 D1.C
  Top 1.778: v1.27,45.72 1.27,60.96 2.11,61.8 C1.+ G1.P$3
  Bottom 1.778: S1.P$6 21.07,49.53 12.7,49.53 10.16,45.72 v1.27,45.72
V+M
  Top 2.54: 23.89,58.42 33.02,58.42 U1.P$7
  Top 3.175: S1.P$3 23.89,58.42

### Text on the board
tPlace: MOTOR DRIVER | LIDAR | IMU | TO BBB